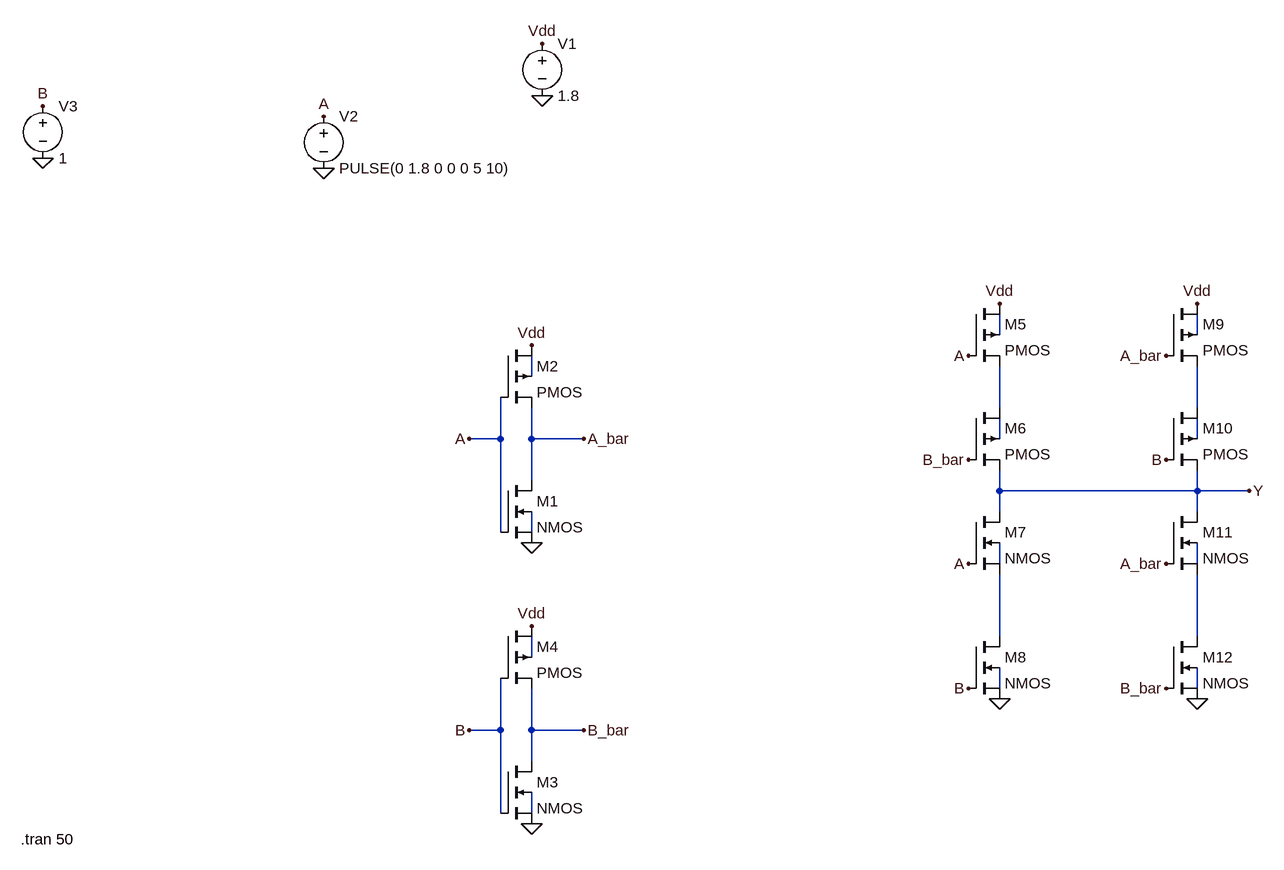
[diagram p0: schematic XOR.asc]
XOR.asc, the LTspice schematic file:
Version 4
SHEET 1 1440 1224
WIRE 1024 432 1024 400
WIRE 1328 432 1328 400
WIRE 304 496 304 464
WIRE 1024 544 1024 480
WIRE 1328 544 1328 480
WIRE 256 592 256 528
WIRE 256 592 208 592
WIRE 304 592 304 544
WIRE 384 592 304 592
WIRE 1024 592 1024 560
WIRE 1328 592 1328 560
WIRE 304 656 304 592
WIRE 1024 672 1024 640
WIRE 1328 672 1328 640
WIRE 1328 672 1024 672
WIRE 1408 672 1328 672
WIRE 1024 704 1024 672
WIRE 1328 704 1328 672
WIRE 256 736 256 592
WIRE 304 736 304 704
WIRE 1024 784 1024 752
WIRE 1328 784 1328 752
WIRE 1024 896 1024 800
WIRE 1328 896 1328 800
WIRE 304 928 304 896
WIRE 1024 976 1024 944
WIRE 1328 976 1328 944
WIRE 256 1040 256 960
WIRE 256 1040 208 1040
WIRE 304 1040 304 976
WIRE 384 1040 304 1040
WIRE 304 1088 304 1040
WIRE 256 1168 256 1040
WIRE 304 1168 304 1136
FLAG 320 -16 Vdd
FLAG 320 64 0
FLAG -16 96 A
FLAG -16 176 0
FLAG -448 80 B
FLAG -448 160 0
FLAG 304 752 0
FLAG 304 448 Vdd
FLAG 384 592 A_bar
FLAG 208 592 A
FLAG 304 1184 0
FLAG 304 880 Vdd
FLAG 208 1040 B
FLAG 384 1040 B_bar
FLAG 1024 384 Vdd
FLAG 1024 992 0
FLAG 1328 384 Vdd
FLAG 1328 992 0
FLAG 1408 672 Y
FLAG 976 464 A
FLAG 1280 464 A_bar
FLAG 976 624 B_bar
FLAG 1280 624 B
FLAG 1280 784 A_bar
FLAG 1280 976 B_bar
FLAG 976 976 B
FLAG 976 784 A
SYMBOL voltage 320 -32 R0
WINDOW 123 0 0 Left 0
WINDOW 39 0 0 Left 0
SYMATTR InstName V1
SYMATTR Value 1.8
SYMBOL voltage -16 80 R0
WINDOW 123 0 0 Left 0
WINDOW 39 0 0 Left 0
SYMATTR InstName V2
SYMATTR Value PULSE(0 1.8 0 0 0 5 10)
SYMBOL voltage -448 64 R0
WINDOW 123 0 0 Left 0
WINDOW 39 0 0 Left 0
SYMATTR InstName V3
SYMATTR Value 1
SYMBOL nmos4 256 656 R0
SYMATTR InstName M1
SYMATTR Value2 l=0.13u w=0.13u
SYMBOL pmos4 256 448 R0
SYMATTR InstName M2
SYMATTR Value2 l=0.13u w=0.13u
SYMBOL nmos4 256 1088 R0
SYMATTR InstName M3
SYMATTR Value2 l=0.13u w=0.13u
SYMBOL pmos4 256 880 R0
SYMATTR InstName M4
SYMATTR Value2 l=0.13u w=0.13u
SYMBOL pmos4 976 384 R0
SYMATTR InstName M5
SYMATTR Value2 l=0.13u w=0.13u
SYMBOL pmos4 976 544 R0
SYMATTR InstName M6
SYMATTR Value2 l=0.13u w=0.13u
SYMBOL nmos4 976 704 R0
SYMATTR InstName M7
SYMATTR Value2 l=0.13u w=0.13u
SYMBOL nmos4 976 896 R0
SYMATTR InstName M8
SYMATTR Value2 l=0.13u w=0.13u
SYMBOL pmos4 1280 384 R0
SYMATTR InstName M9
SYMATTR Value2 l=0.13u w=0.13u
SYMBOL pmos4 1280 544 R0
SYMATTR InstName M10
SYMATTR Value2 l=0.13u w=0.13u
SYMBOL nmos4 1280 704 R0
SYMATTR InstName M11
SYMATTR Value2 l=0.13u w=0.13u
SYMBOL nmos4 1280 896 R0
SYMATTR InstName M12
SYMATTR Value2 l=0.13u w=0.13u
TEXT -482 1208 Left 2 !.tran 50

The netlist it stands for:
* XOR.asc
V1 Vdd 0 1.8
V2 A 0 PULSE(0 1.8 0 0 0 5 10)
V3 B 0 1
M1 A_bar A 0 N008 NMOS l=0.13u w=0.13u
M2 Vdd A A_bar N003 PMOS l=0.13u w=0.13u
M3 B_bar B 0 N016 NMOS l=0.13u w=0.13u
M4 Vdd B B_bar N013 PMOS l=0.13u w=0.13u
M5 Vdd A N004 N001 PMOS l=0.13u w=0.13u
M6 N004 B_bar Y N006 PMOS l=0.13u w=0.13u
M7 Y A N011 N009 NMOS l=0.13u w=0.13u
M8 N011 B 0 N014 NMOS l=0.13u w=0.13u
M9 Vdd A_bar N005 N002 PMOS l=0.13u w=0.13u
M10 N005 B Y N007 PMOS l=0.13u w=0.13u
M11 Y A_bar N012 N010 NMOS l=0.13u w=0.13u
M12 N012 B_bar 0 N015 NMOS l=0.13u w=0.13u
.model NMOS NMOS
.model PMOS PMOS
.lib standard.mos
.tran 50
.backanno
.end